# EAGLE design xfeed (EAGLE 5.04)
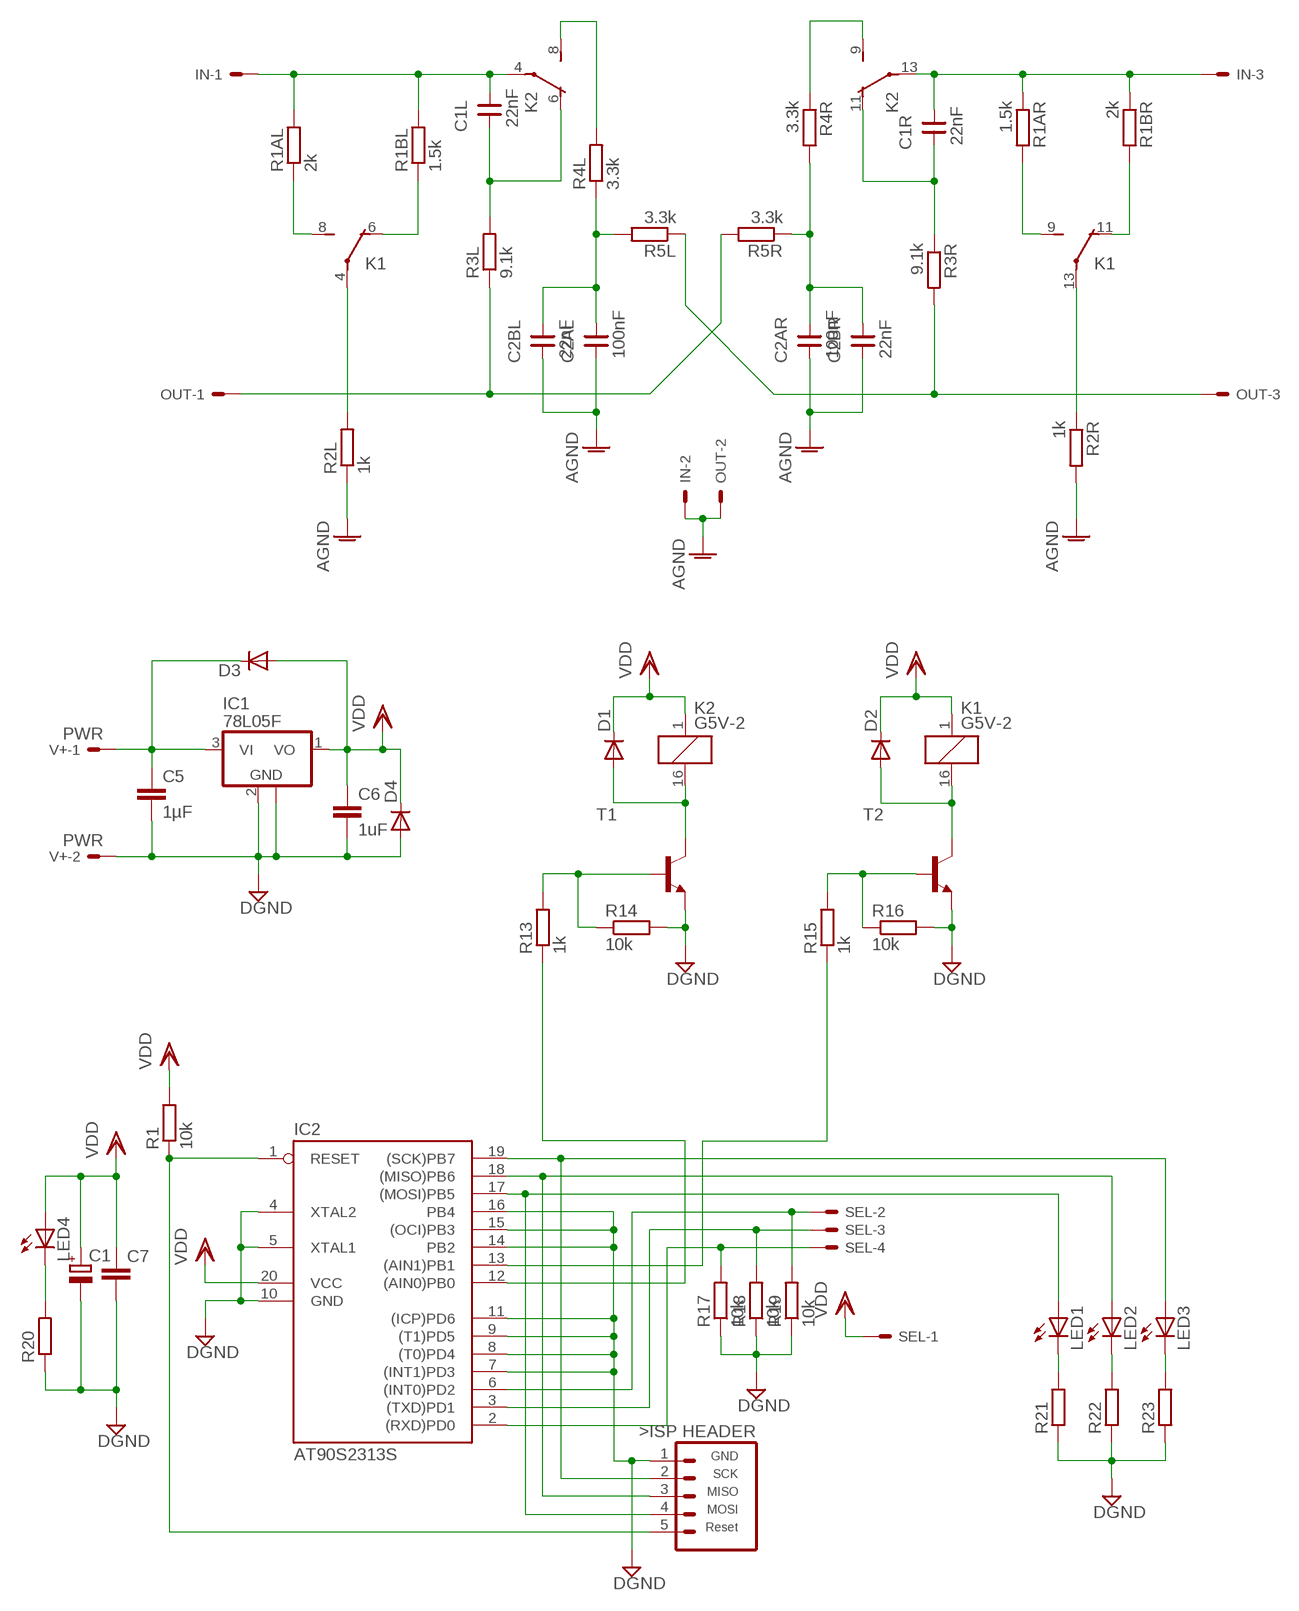
[diagram p0: schematic, sheet 1]

## Parts
C1  CPOL-EUC  [PANASONIC_C]
C1L  22nF  PANA-ECPQECQP1H223  [PANA-ECQP1H223]
C1R  22nF  PANA-ECPQECQP1H223  [PANA-ECQP1H223]
C2AL  100nF  PANA-ECPQECQP1H104  [PANA-ECQP1H104]
C2AR  100nF  PANA-ECPQECQP1H104  [PANA-ECQP1H104]
C2BL  22nF  PANA-ECPQECQP1H223  [PANA-ECQP1H223]
C2BR  22nF  PANA-ECPQECQP1H223  [PANA-ECQP1H223]
C5  1µF  C-EUC0805  [C0805]
C6  1uF  C-EUC0805  [C0805]
C7  C-EUC0603  [C0603]
D1  DIODE-SOD323-W  [SOD323-W]
D2  DIODE-SOD323-W  [SOD323-W]
D3  DIODE-SOD323-W  [SOD323-W]
D4  DIODE-DO214AA  [DO214AA]
IC1  78L05F  [SOT89]
IC2  AT90S2313S  [SO20L]
IN  KK-156-3  [KK-156-3]
ISP  ISPHEADER  [1X05]
K1  G5V-2  [G5V-2]
K2  G5V-2  [G5V-2]
LED1  LED0603  [LED-0603]
LED2  LED0603  [LED-0603]
LED3  LED0603  [LED-0603]
LED4  LED0603  [LED-0603]
OUT  KK-156-3  [KK-156-3]
R1  10k  R-EU_R0603  [R0603]
R1AL  2k  R-EU_R0805  [R0805]
R1AR  1.5k  R-EU_R0805  [R0805]
R1BL  1.5k  R-EU_R0805  [R0805]
R1BR  2k  R-EU_R0805  [R0805]
R2L  1k  R-EU_R0805  [R0805]
R2R  1k  R-EU_R0805  [R0805]
R3L  9.1k  R-EU_R0805  [R0805]
R3R  9.1k  R-EU_R0805  [R0805]
R4L  3.3k  R-EU_R0805  [R0805]
R4R  3.3k  R-EU_R0805  [R0805]
R5L  3.3k  R-EU_R0805  [R0805]
R5R  3.3k  R-EU_R0805  [R0805]
R13  1k  R-EU_R0603  [R0603]
R14  10k  R-EU_R0603  [R0603]
R15  1k  R-EU_R0603  [R0603]
R16  10k  R-EU_R0603  [R0603]
R17  10k  R-EU_R0603  [R0603]
R18  10k  R-EU_R0603  [R0603]
R19  10k  R-EU_R0603  [R0603]
R20  R-EU_R0603  [R0603]
R21  R-EU_R0603  [R0603]
R22  R-EU_R0603  [R0603]
R23  R-EU_R0603  [R0603]
SEL  KK-156-4  [KK-156-4]
T1  BC850SOT323  [SOT323-BEC]
T2  BC850SOT323  [SOT323-BEC]
V+  PWR  KK-156-2  [KK-156-2]

## Nets
AGND: C2AL.P$1 C2AR.P$1 C2BL.P$1 C2BR.P$1 IN.2 OUT.2 R2L.1 R2R.2
C1R: C1R.P$1 K2.11(2:O) R3R.1
DGND: C1.- C5.2 C6.2 C7.2 D4.A IC1.2(GND) IC1.2@1(GND) IC2.4(XTAL2) IC2.5(XTAL1) IC2.7((INT1)PD3) IC2.8((T0)PD4) IC2.9((T1)PD5) IC2.10(GND) IC2.11((ICP)PD6) IC2.14(PB2) IC2.15((OCI)PB3) IC2.16(PB4) ISP.1(GND) R14.2 R16.2 R17.1 R18.1 R19.1 R20.1 R21.1 R22.1 R23.1 T1.E T2.E V+.2
N$1: C1L.P$2 IN.1 K2.4(1:P) R1AL.2 R1BL.2
N$2: C1L.P$1 K2.6(1:O) R3L.2
N$3: OUT.1 R3L.1 R5R.2
N$4: OUT.3 R3R.2 R5L.1
N$5: C2AL.P$2 C2BL.P$2 R4L.1 R5L.2
N$6: C2AR.P$2 C2BR.P$2 R4R.2 R5R.1
N$7: C1R.P$2 IN.3 K2.13(2:P) R1AR.1 R1BR.1
N$9: K1.4(1:P) R2L.2
N$10: K1.8(1:S) R1AL.1
N$11: K1.6(1:O) R1BL.1
N$12: K1.9(2:S) R1AR.2
N$13: K1.11(2:O) R1BR.2
N$14: D1.A K2.16 T1.C
N$15: D2.A K1.16 T2.C
N$16: K2.8(1:S) R4L.2
N$17: K2.9(2:S) R4R.1
N$18: IC2.1(RESET) ISP.5(RST) R1.1
N$19: IC2.17((MOSI)PB5) ISP.4(MOSI) LED1.A
N$21: R15.2 R16.1 T2.B
N$22: R13.2 R14.1 T1.B
N$23: C5.1 D3.C IC1.3(VI) V+.1
N$24: K1.13(2:P) R2R.1
N$26: IC2.2((RXD)PD0) R17.2 SEL.4
N$27: IC2.12((AIN0)PB0) R13.1
N$28: IC2.13((AIN1)PB1) R15.1
N$29: IC2.3((TXD)PD1) R18.2 SEL.3
N$30: IC2.6((INT0)PD2) R19.2 SEL.2
N$32: LED1.C R21.2
N$33: IC2.18((MISO)PB6) ISP.3(MISO) LED2.A
N$35: LED2.C R22.2
N$36: LED3.C R23.2
N$38: LED4.C R20.2
N$41: IC2.19((SCK)PB7) ISP.2(SCK) LED3.A
VDD: C1.+ C6.1 C7.1 D1.C D2.C D3.A D4.C IC1.1(VO) IC2.20(VCC) K1.1 K2.1 LED4.A R1.2 SEL.1

## Library data of the parts
C1 = rcl:CPOL-EU: POLARIZED CAPACITOR, European symbol
C1L C1R C2AL C2AR C2BL C2BR = additional:PANA-ECPQ
C5-C7 = rcl:C-EU: CAPACITOR, European symbol
D1-D4 = diode:DIODE-: DIODE
IC1 = linear:78L*: POSITOIV-VOLTAGE REGULATORS Output up to 100 mA Source: http://focus.ti.com/lit/ds/symlink/ua78l05.pdf
IC2 = atmel:AT90S2313: MICROCONTROLLER 2 Kbytes FLASH 128 bytes SRAM 128 bytes EEPROM UART
IN OUT = con-molex:KK-156-3: KK 156 HEADER Source: http://www.molex.com/pdm_docs/sd/026604100_sd.pdf
ISP = tuxgraphics:ISPHEADER: ISP Header for tuxgraphics.org AvrUsb500 programmer
K1 K2 = relay:G5V-2: OMRON PCB Relay Source: http://www.omron.com/ecb/products/pdf/en-g5v2.pdf
LED1-LED4 = SparkFun:LED: LEDs Standard schematic elements and footprints for 5mm, 3mm, 1206, and 0603 sized LEDs. 5mm - Spark Fun Electronics SKU : COM-00529 (and others)
R1 R1AL R1AR R1BL R1BR R2L R2R R3L R3R R4L R4R R5L R5R R13-R23 = rcl:R-EU_: RESISTOR, European symbol
SEL = con-molex:KK-156-4: KK 156 HEADER Source: http://www.molex.com/pdm_docs/sd/026604100_sd.pdf
T1 T2 = additional:BC850: NPN TRANSISTOR
V+ = con-molex:KK-156-2: KK 156 HEADER Source: http://www.molex.com/pdm_docs/sd/026604100_sd.pdf

## Board
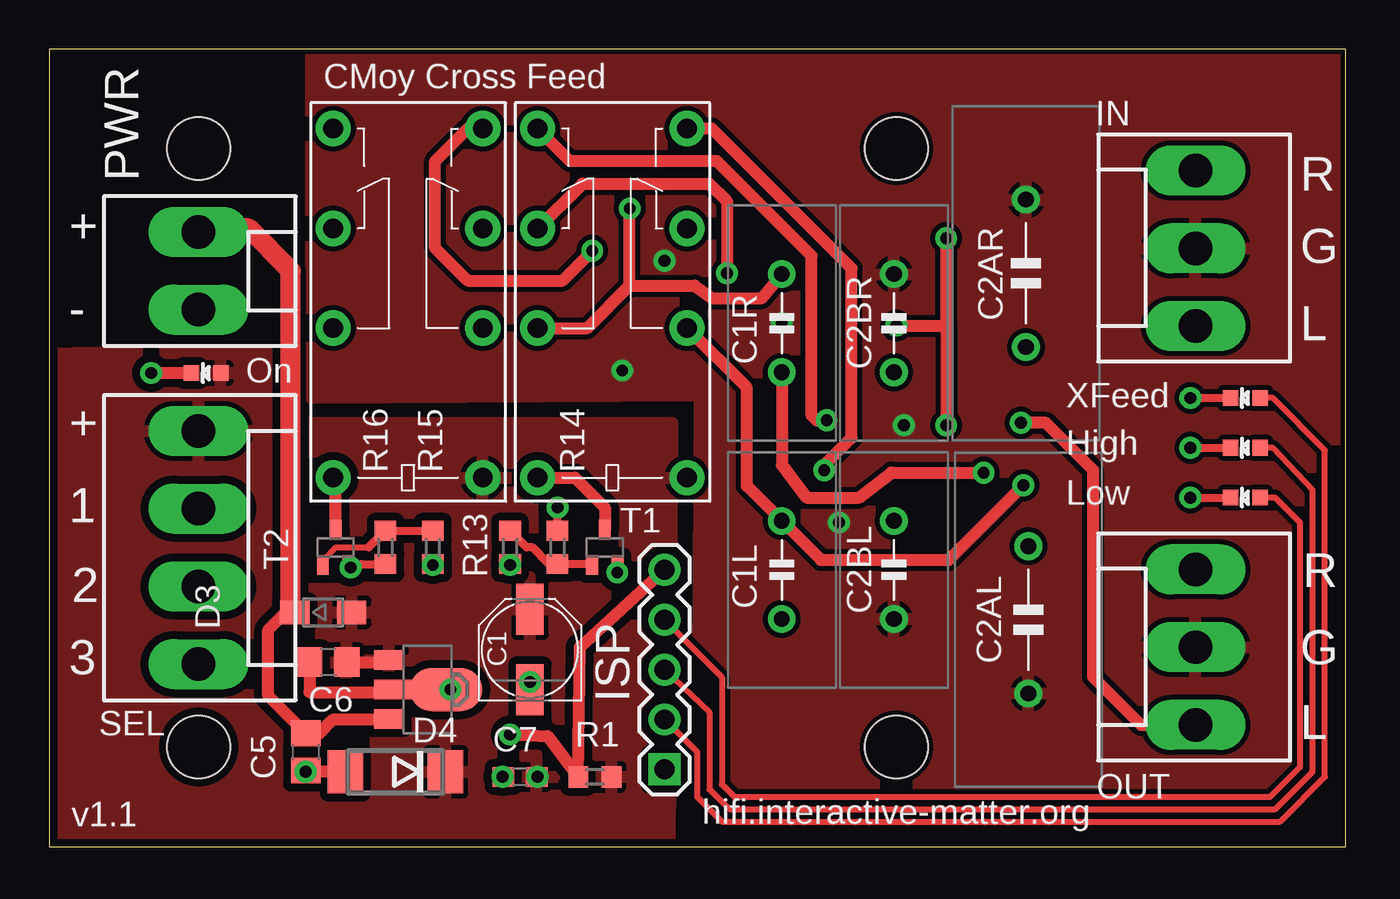
[diagram p1: board, top side]
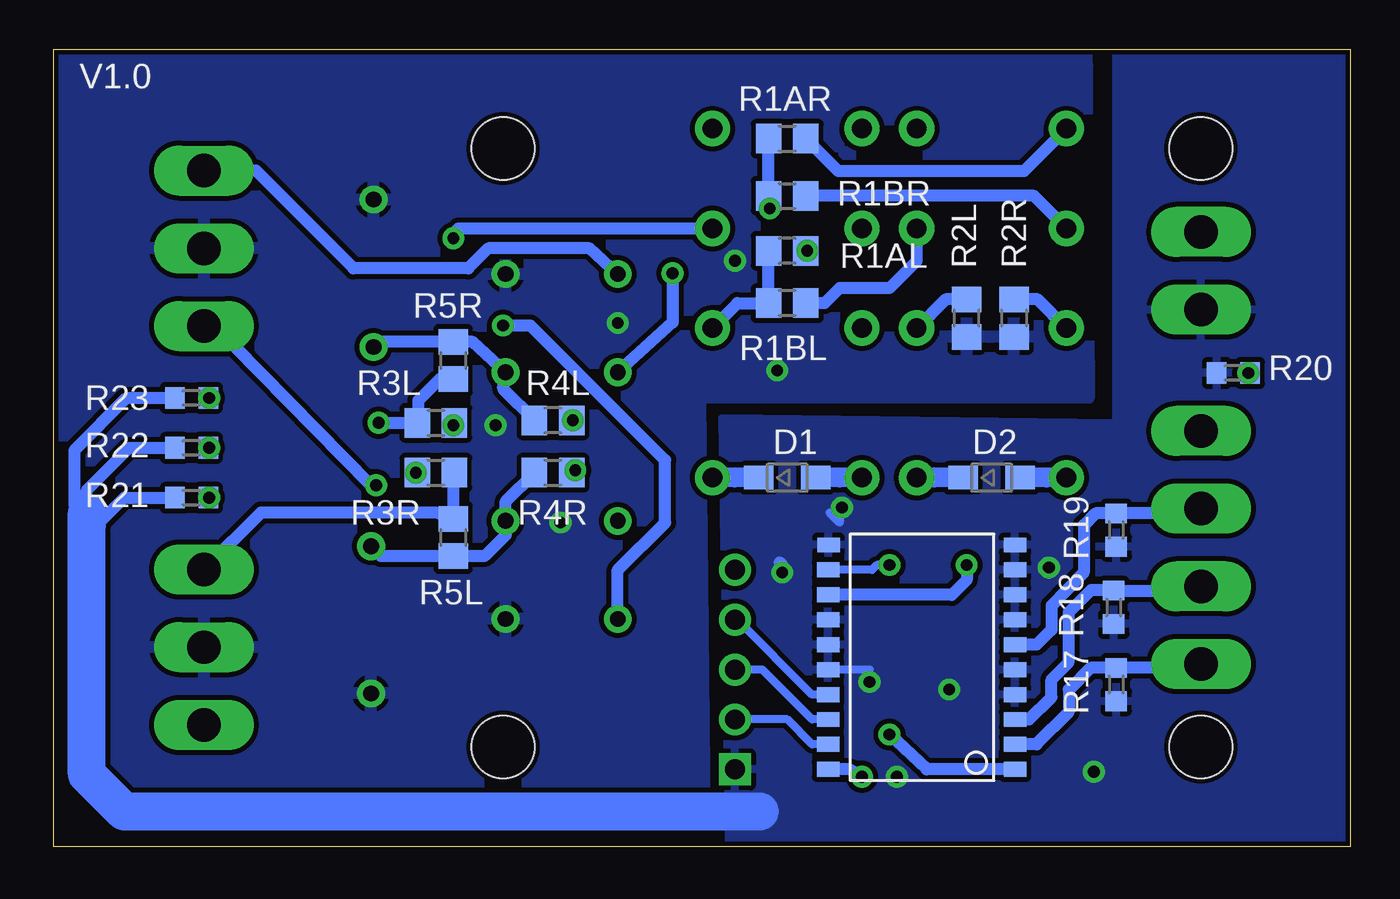
[diagram p2: board, bottom side, seen from below]

Size 66.09 x 40.63 mm. Coordinates in mm from the lower left corner, seen from the top.
Outline: 0,0 66.09,0 66.09,40.63 0,40.63 0,0
Copper layers (1*16): Top 0.035mm / dielectric 1.5mm / Bottom 0.035mm
Design rules "SparkFun.strict": minimum track width 10mil, minimum drill 20mil, track to track 10mil, track to pad 10mil, pad to pad 10mil, via to via 10mil, smd to smd 0mil, copper to edge 10mil, drill to drill 8mil, minimum pad ring 12mil, minimum via ring 10mil, stop-mask expansion 4mil, vias tented up to drill 25mil, thermal gap 10mil
Holes 3.2 mm at 7.62,35.56 43.18,35.56 7.62,5.08 43.18,5.08

### Footprints (pad centres in the part's own frame; a part is rotated, then mirrored left to right if it is on the bottom)
PANASONIC_C = smd 2.6 x 1.4: + 2.05,0; - -2.05,0
PANA-ECQP1H223 = drill 0.8 round: P$1 -2.5,0; P$2 2.5,0
PANA-ECQP1H104 = drill 0.8 round: P$1 -3.75,0; P$2 3.75,0
C0805 = smd 1.3 x 1.5: 1 -0.95,0; 2 0.95,0
C0603 = smd 1.1 x 1: 1 -0.85,0; 2 0.85,0
SOD323-W = smd 1.5 x 1.2: A 1.45,0; C -1.45,0
DO214AA = smd 1.8 x 2.2: A 2.55,0; C -2.55,0
SOT89 = smd 1 x 1.5: 1 -1.499,-1.981; 3 1.499,-1.981 | smd 1 x 2: 2 0,-1.727 | smd 2.2 x 3.7: 2@1 0,0.94
SO20L = smd 0.762 x 1.143: 1 -5.08,-5.131; 2 -3.81,-5.131; 3 -2.54,-5.131; 4 -1.27,-5.131; 5 0,-5.131; 6 1.27,-5.131; 7 2.54,-5.131; 8 3.81,-5.131; 9 5.08,-5.131; 10 6.35,-5.131; 11 6.35,4.369; 12 5.08,4.394; 13 3.81,4.394; 14 2.54,4.394; 15 1.27,4.394; 16 0,4.394; 17 -1.27,4.394; 18 -2.54,4.394; 19 -3.81,4.394; 20 -5.08,4.394
KK-156-3 = drill 1.7 pad 2.184 long: 1 -3.96,0; 2 0,0; 3 3.96,0
1X05 = drill 1.016 square: 1 0,0 | drill 1.016 round: 2 2.54,0; 3 5.08,0; 4 7.62,0; 5 10.16,0
G5V-2 = drill 1 pad 1.8 round: 1 -8.89,-3.81; 4 -1.27,-3.81; 6 3.81,-3.81; 8 8.89,-3.81; 9 8.89,3.81; 11 3.81,3.81; 13 -1.27,3.81; 16 -8.89,3.81
LED-0603 = smd 0.8 x 0.8: A 0,-0.75; C 0,0.75
R0603 = smd 1 x 1.1: 1 -0.85,0; 2 0.85,0
R0805 = smd 1.3 x 1.5: 1 -0.95,0; 2 0.95,0
KK-156-4 = drill 1.7 pad 2.184 long: 1 -5.94,0; 2 -1.98,0; 3 1.98,0; 4 5.94,0
SOT323-BEC = smd 0.6 x 1: B -0.65,-0.9; C 0,0.9; E 0.65,-0.9
KK-156-2 = drill 1.7 pad 2.184 long: 1 -1.98,0; 2 1.98,0

### Placement (x,y rotation side)
C1  24.51,10.03 90 top
C1L  37.34,14.1 90 top
C1R  37.34,26.67 90 top
C2AL  49.91,11.56 90 top
C2AR  49.78,29.21 270 top
C2BL  43.05,14.1 90 top
C2BR  43.05,26.67 270 top
C5  13.08,4.83 270 top
C6  14.22,9.4 180 top
C7  24,3.56 180 top
D1  28.7,18.8 0 bottom
D2  18.29,18.8 0 bottom
D3  13.97,11.94 0 top
D4  17.65,3.81 180 top
IC1  19.3,8 270 top
IC2  22.22,9.02 90 bottom
IN  58.42,30.48 90 top
ISP  31.37,3.94 90 top
K1  18.29,27.69 90 top
K2  28.7,27.69 90 top
LED1  60.96,17.78 90 top
LED2  60.96,20.32 90 top
LED3  60.96,22.86 90 top
LED4  8,24.13 90 top
OUT  58.42,10.16 90 top
R1  27.81,3.56 0 top
R1AL  28.7,30.35 180 bottom
R1AR  28.7,36.07 0 bottom
R1BL  28.7,27.69 180 bottom
R1BR  28.7,33.15 0 bottom
R2L  19.56,26.92 90 bottom
R2R  17.14,26.92 270 bottom
R3L  46.61,21.59 0 bottom
R3R  46.61,19.05 0 bottom
R4L  40.64,19.05 0 bottom
R4R  40.64,21.72 180 bottom
R5L  45.72,15.75 270 bottom
R5R  45.72,24.77 270 bottom
R13  23.49,15.24 90 top
R14  25.91,15.24 90 top
R15  19.56,15.24 90 top
R16  17.14,15.24 270 top
R17  11.94,8.26 90 bottom
R18  12.06,12.19 90 bottom
R19  11.94,16.13 90 bottom
R20  5.97,24.13 0 bottom
R21  59.05,17.78 0 bottom
R22  59.05,20.32 0 bottom
R23  59.05,22.86 0 bottom
SEL  7.62,15.24 270 top
T1  28.32,15.24 0 top
T2  14.61,15.24 0 top
V+  7.62,29.34 270 top

### Tracks (layer width: path | path; a pad name or v marks a point on that pad's centre or on a via)
AGND  (via drill 0.6)
  other vias: 37.34,26.67 31.37,29.84 29.21,24.26 40.26,16.51 43.56,21.46
  pour Bottom (isolate 0.254): 13.46,41.78 13.33,22.86 33.15,22.86 32.89,-0.76 67.56,-0.13 67.56,41.78
  pour Top (isolate 0.254): 13.33,41.4 13.33,22.86 33.15,22.99 33.02,-0.13 66.67,-0.13 66.67,41.53
C1R  (via drill 0.6)
  Top 0.61: K2.11 27.18,33.78 33.66,33.78 34.54,32.89 v34.54,29.21 | C1R.P$1 37.34,19.43 38.61,17.78 41.28,17.78 42.93,19.05 v47.62,19.05
  Bottom 0.61: v34.54,29.21 34.54,26.71 C1R.P$1 | v47.62,19.05 R3R.1
DGND  (via drill 0.6)
  Top 0.406: R14.2 v25.91,17.27 | R16.2 15.91,14.39 v15.37,14.22 15.86,14.34 T2.E | C1.- v24.51,8.38
  Top 0.61: 17.58,7.87 IC1.2 | C6.2 13.27,7.87 17.58,7.87 | v20.45,8 IC1.2@1 17.7,8 17.58,7.87 | C7.2 v23.11,3.56 | T1.E 28.97,13.98 v28.96,13.97 | D4.A 13.15,3.81 C5.2 13.14,3.75 v13.08,3.81
  Bottom 0.406: v25.91,17.27 26.04,16.51 26.54,17.02 | v15.37,14.22 15.37,13.84 | v24.51,8.38 24.51,9.02 IC2.16
  Bottom 0.61: v20.45,8 20.7,8 | v23.11,3.56 23.24,3.68 | v28.96,13.97 28.96,14.35 29.08,14.48 | v13.08,3.81 12.95,3.94 | R22.1 62.23,20.32 64.39,18.16 64.39,17.78 64.01,17.4 64.39,17.02 64.64,17.27 64.9,17.27 65.02,17.4 65.02,20.19 62.36,22.86 R23.1 | R21.1 62.48,17.78 63.88,16.38 64.39,16.38
  Bottom 1.93: 64.39,17.02 64.39,16.38 64.39,3.68 62.48,1.78 30.1,1.78
  pour Bottom: -0.89,41.02 -0.89,-2.41 31.62,-2.54 32,21.84 11.94,21.59 11.94,41.02
N$1  (via drill 0.6)
  Top 0.61: K2.4 35.56,23.37 35.56,18.38 C1L.P$2 39.33,14.61 45.85,14.61 v49.66,18.41
  Bottom 0.61: R1AL.2 R1BL.2 31.24,27.69 K2.4 | IN.1 56.9,25.53 49.91,18.41 v49.66,18.41
N$2  (via drill 0.6)
  Top 0.61: 45.72,26.54 v45.72,30.99 | 45.72,26.54 v45.72,21.46 | v43.18,26.54 45.72,26.54
  Bottom 0.61: K2.6 45.47,31.5 v45.72,30.99 | v45.72,21.46 45.72,21.53 R3L.2 | C1L.P$1 37.34,14.1 34.93,16.51 34.93,19.68 41.78,26.54 v43.18,26.54
N$3  (via drill 0.6)
  Top 0.61: OUT.1 55.65,6.2 53.21,8.64 53.21,19.18 50.8,21.59 v49.53,21.59
  Bottom 0.61: R5R.2 46.42,23.82 47.5,22.73 47.5,21.65 R3L.1 v49.53,21.59
N$4
  Bottom 0.61: R3R.2 45.72,18.99 R5L.1 45.78,16.7 46.61,17.02 55.52,17.02 OUT.3
N$5
  Bottom 0.61: R4L.1 43.05,17.59 C2BL.P$2 43.05,15.88 44.13,14.8 R5L.2 49.4,14.8 C2AL.P$2
N$6
  Bottom 0.61: R4R.2 43.18,23.31 C2BR.P$2 44.73,25.71 R5R.1 49.53,25.71 C2AR.P$2
N$7  (via drill 0.6)
  Top 0.61: K2.13 27.43,26.42 29.59,28.57 | 29.59,28.57 v29.59,32.51 | 29.59,28.57 32.89,28.57 33.78,27.94 36.32,27.94 C1R.P$2
  Bottom 0.61: R1AR.1 R1BR.1 29.59,33.09 v29.59,32.51 | C1R.P$2 38.78,30.48 43.94,30.48 44.96,29.46 50.8,29.46 55.78,34.44 IN.3
N$9
  Bottom 0.61: K1.4 20.64,27.87 R2L.2
N$10  (via drill 0.6)
  Top 0.61: K1.8 21.34,36.58 19.68,34.92 19.68,30.48 21.34,28.83 26.16,28.83 v27.69,30.35
  Bottom 0.61: v27.69,30.35 27.62,30.23 R1AL.1
N$11
  Bottom 0.61: K1.6 22.1,29.84 23.49,28.45 26.04,28.45 26.8,27.69 R1BL.1
N$12
  Bottom 0.61: K1.9 16.64,34.42 26.1,34.42 R1AR.2
N$13
  Bottom 0.61: K1.11 16.13,33.15 R1BR.2
N$14
  Top 0.61: T1.C 28.32,17.27 26.8,18.8 K2.16
  Bottom 1.016: K2.16 26.04,18.81 D1.A
N$15
  Top 0.61: T2.C 14.61,18.67 K1.16
  Bottom 1.016: K1.16 15.49,18.81 D2.A
N$16  (via drill 0.6)
  Top 0.61: v39.5,19.18 39.5,19.43 40.89,20.83 40.89,29.46 33.78,36.58 K2.8
  Bottom 0.61: R4L.2 39.62,19.05 v39.5,19.18
N$17  (via drill 0.6)
  Top 0.61: v39.62,21.72 39.12,21.72 38.86,21.97 38.86,30.1 34.04,34.92 26.54,34.92 K2.9
  Bottom 0.61: 39.75,21.72 R4R.1 v39.62,21.72 39.5,21.72
N$18  (via drill 0.6)
  Top 0.61: ISP.5 27.05,10.16 R1.1 25.4,5.63 v23.49,5.71
  Bottom 0.61: v23.49,5.71 21.59,3.94 IC2.1
N$19
  Top 0.305: ISP.4 34.29,8.64 34.29,3.17 34.93,2.54 62.23,2.54 63.75,4.06 63.75,16.51 62.48,17.78 LED1.A
  Bottom 0.406: IC2.17 27.43,7.75 31.24,11.56 ISP.4
N$21
  Top 0.305: 13.95,14.59 14.61,15.24 16.29,15.24
  Top 0.406: T2.B 13.95,14.59 | 16.29,15.24 R16.1 R15.2
N$22
  Top 0.406: T1.B 27.62,14.39 R14.1 25.49,14.39 24.64,15.24 24.34,15.24 R13.2
N$23
  Top 0.61: 17.32,6.48 IC1.3 17.3,6.48 14.48,6.48 13.78,5.78 C5.1 11.18,7.68 11.18,11.05 12.06,11.94 D3.C
  Top 1.016: V+.1 7.93,31.5 10.16,31.5 12.32,29.34 12.32,12.06 12.45,11.94 D3.C
N$24
  Bottom 0.61: K1.13 15.94,27.87 R2R.1
N$26
  Bottom 0.61: SEL.4 8,9.11 R17.2 13.25,9.11 14.35,8 14.35,6.86 16,5.21 IC2.2
N$27  (via drill 0.6)
  Top 0.406: v23.49,14.35 23.79,14.1 R13.1
  Bottom 0.406: IC2.12 24.38,14.1 24.13,14.35 v23.49,14.35
N$28  (via drill 0.6)
  Top 0.61: R15.1 v19.56,14.35
  Bottom 0.61: IC2.13 20.32,12.83 19.56,13.59 v19.56,14.35
N$29
  Bottom 0.61: SEL.3 8,13.04 R18.2 12.1,13.08 13.21,13.08 14.35,11.94 14.35,9.4 15.24,8.51 15.24,7.62 16.38,6.48 IC2.3
N$30
  Bottom 0.61: SEL.2 8,16.98 R19.2 12.99,16.98 13.59,16.38 13.59,13.97 15.24,12.28 15.24,11.05 16,10.29 IC2.6
N$32  (via drill 0.6)
  Top 0.406: v58.17,17.78 LED1.C
  Bottom 0.406: R21.2 v58.17,17.78
N$33
  Top 0.305: ISP.3 33.66,6.86 33.66,2.92 34.67,1.91 62.48,1.91 64.39,3.81 64.39,18.16 62.36,20.32 LED2.A
  Bottom 0.406: IC2.18 27.43,6.48 29.97,9.02 ISP.3
N$35  (via drill 0.6)
  Top 0.406: v58.17,20.32 LED2.C
  Bottom 0.406: R22.2 v58.17,20.32
N$36  (via drill 0.6)
  Top 0.406: v58.17,22.86 LED3.C
  Bottom 0.406: R23.2 v58.17,22.86
N$38  (via drill 0.6)
  Top 0.61: v5.21,24.13 LED4.C
  Bottom 0.61: R20.2 v5.21,24.13
N$41
  Top 0.305: ISP.2 33.02,4.83 33.02,2.54 34.29,1.27 62.74,1.27 65.02,3.56 65.02,20.19 62.36,22.86 LED3.A
  Bottom 0.406: IC2.19 27.43,5.21 28.7,6.48 ISP.2
VDD  (via drill 0.6)
  Top 0.61: IC1.1 17.32,9.4 C6.1 | C7.1 v24.89,3.56
  Bottom 0.61: IC2.20 25.53,3.94 v24.89,3.56
  Bottom 1.016: D2.C 21.21,18.81 K1.1 | K2.1 31.37,18.81 D1.C
  pour Top (isolate 0.406): 12.06,21.59 31.75,21.59 31.62,1.02 12.45,1.14
  pour Top (isolate 0.406): 12.06,21.59 31.75,21.59 31.62,1.02 12.45,1.14
  pour Top (isolate 0.406): 12.06,21.59 31.75,21.59 31.62,1.02 12.45,1.14
  pour Top (isolate 0.406): 12.06,21.59 31.75,21.59 31.62,1.02 12.45,1.14
  pour Top (isolate 0.406): -1.4,21.59 -1.52,25.15 12.19,25.27 12.06,21.59 31.75,21.59 31.62,-0.25 -0.51,-0.38

### Text on the board
tPlace: PWR
tNames: CMoy Cross Feed | R | + | G | - | L | On | XFeed | + | High | 1 | Low | R | 2 | 3 | G | ISP | L | v1.1 | hifi.interactive-matter.org
bNames: V1.0